# Altium schematic sheet passive_balancing.SchDoc: foxBMS BMS-Slave 12-Cell
size A3; DocumentNumber: 7; SheetNumber: 7; SheetTotal: 19; AUTHOR: Fraunhofer IISB foxBMS Team; SheetDescription: Passive Cell Balancing
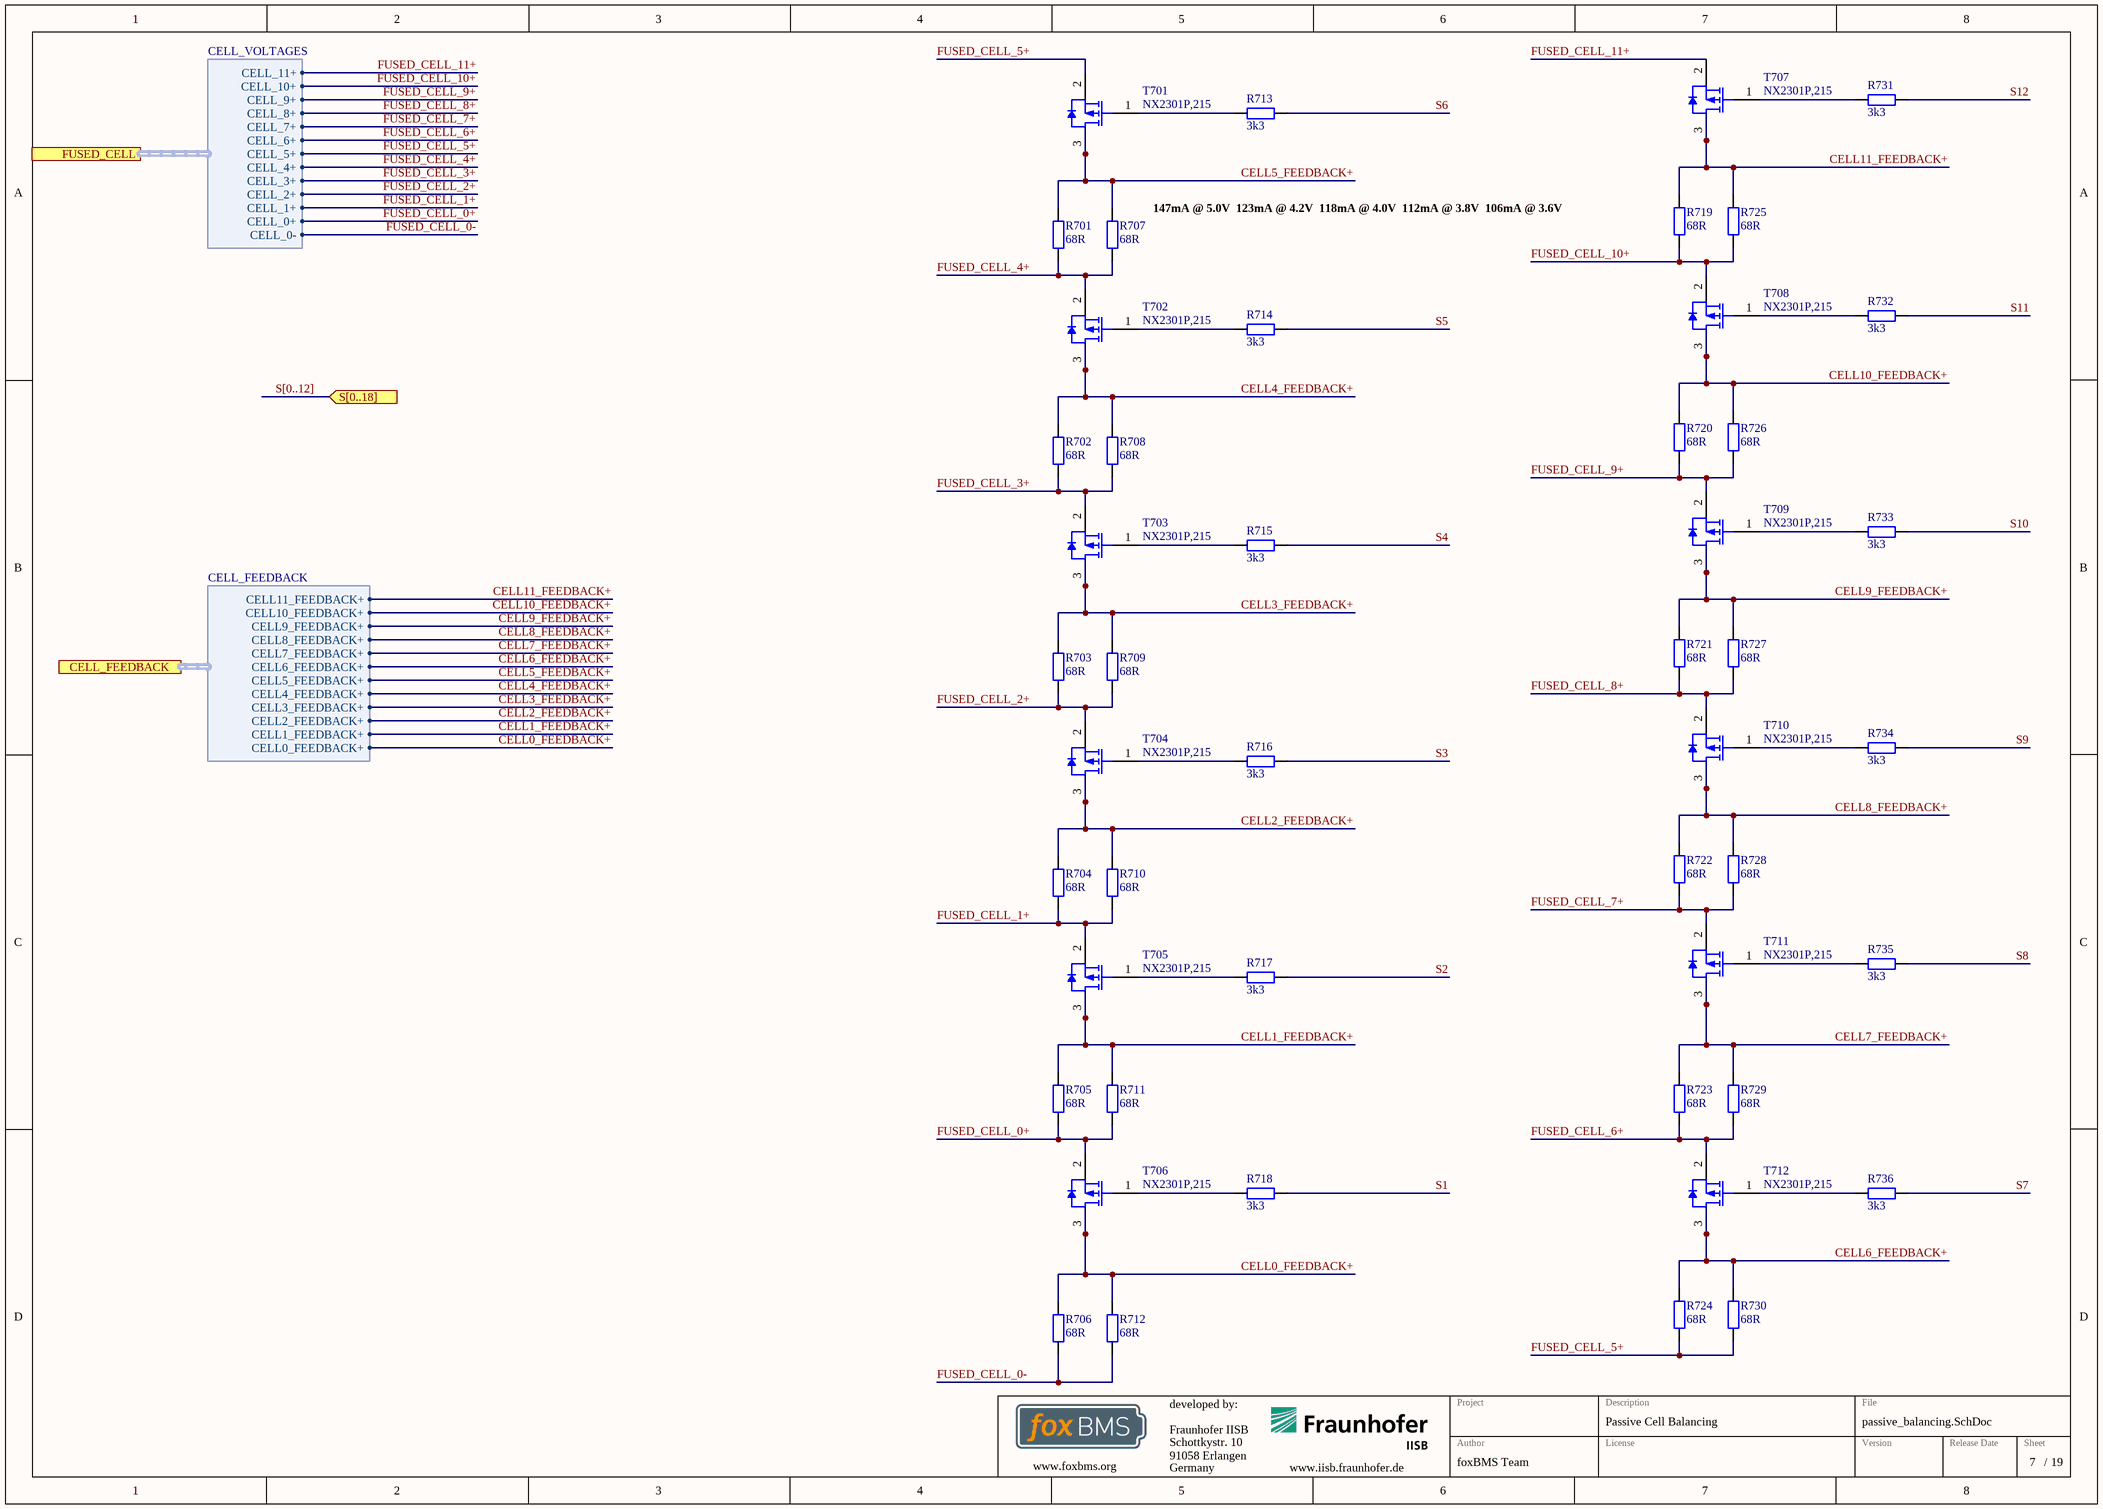
[diagram p0: passive_balancing.SchDoc]

## Parts
R701  68R  [RESC5025X07N]
R702  68R  [RESC5025X07N]
R703  68R  [RESC5025X07N]
R704  68R  [RESC5025X07N]
R705  68R  [RESC5025X07N]
R706  68R  [RESC5025X07N]
R707  68R  [RESC5025X07N]
R708  68R  [RESC5025X07N]
R709  68R  [RESC5025X07N]
R710  68R  [RESC5025X07N]
R711  68R  [RESC5025X07N]
R712  68R  [RESC5025X07N]
R713  3k3  [RESC1608X05N]
R714  3k3  [RESC1608X05N]
R715  3k3  [RESC1608X05N]
R716  3k3  [RESC1608X05N]
R717  3k3  [RESC1608X05N]
R718  3k3  [RESC1608X05N]
R719  68R  [RESC5025X07N]
R720  68R  [RESC5025X07N]
R721  68R  [RESC5025X07N]
R722  68R  [RESC5025X07N]
R723  68R  [RESC5025X07N]
R724  68R  [RESC5025X07N]
R725  68R  [RESC5025X07N]
R726  68R  [RESC5025X07N]
R727  68R  [RESC5025X07N]
R728  68R  [RESC5025X07N]
R729  68R  [RESC5025X07N]
R730  68R  [RESC5025X07N]
R731  3k3  [RESC1608X05N]
R732  3k3  [RESC1608X05N]
R733  3k3  [RESC1608X05N]
R734  3k3  [RESC1608X05N]
R735  3k3  [RESC1608X05N]
R736  3k3  [RESC1608X05N]
T701  NX2301P,215  [NXP-SOT23_N]
T702  NX2301P,215  [NXP-SOT23_N]
T703  NX2301P,215  [NXP-SOT23_N]
T704  NX2301P,215  [NXP-SOT23_N]
T705  NX2301P,215  [NXP-SOT23_N]
T706  NX2301P,215  [NXP-SOT23_N]
T707  NX2301P,215  [NXP-SOT23_N]
T708  NX2301P,215  [NXP-SOT23_N]
T709  NX2301P,215  [NXP-SOT23_N]
T710  NX2301P,215  [NXP-SOT23_N]
T711  NX2301P,215  [NXP-SOT23_N]
T712  NX2301P,215  [NXP-SOT23_N]

## Ports
CELL_FEEDBACK (harness CELL_FEEDBACK), FUSED_CELL (harness CELL_VOLTAGES), S[0..18] (in)

## Harnesses
CELL_VOLTAGES: CELL_0-, CELL_0+, CELL_1+, CELL_10+, CELL_11+, CELL_2+, CELL_3+, CELL_4+, CELL_5+, CELL_6+, CELL_7+, CELL_8+, CELL_9+
CELL_FEEDBACK: CELL11_FEEDBACK+, CELL10_FEEDBACK+, CELL9_FEEDBACK+, CELL8_FEEDBACK+, CELL7_FEEDBACK+, CELL6_FEEDBACK+, CELL5_FEEDBACK+, CELL4_FEEDBACK+, CELL3_FEEDBACK+, CELL2_FEEDBACK+, CELL1_FEEDBACK+, CELL0_FEEDBACK+

## Nets
CELL0_FEEDBACK+: R706.2 R712.2 T706.3(D) ; port CELL_FEEDBACK.CELL0_FEEDBACK+
CELL1_FEEDBACK+: R705.2 R711.2 T705.3(D) ; port CELL_FEEDBACK.CELL1_FEEDBACK+
CELL2_FEEDBACK+: R704.2 R710.2 T704.3(D) ; port CELL_FEEDBACK.CELL2_FEEDBACK+
CELL3_FEEDBACK+: R703.2 R709.2 T703.3(D) ; port CELL_FEEDBACK.CELL3_FEEDBACK+
CELL4_FEEDBACK+: R702.2 R708.2 T702.3(D) ; port CELL_FEEDBACK.CELL4_FEEDBACK+
CELL5_FEEDBACK+: R701.2 R707.2 T701.3(D) ; port CELL_FEEDBACK.CELL5_FEEDBACK+
CELL6_FEEDBACK+: R724.2 R730.2 T712.3(D) ; port CELL_FEEDBACK.CELL6_FEEDBACK+
CELL7_FEEDBACK+: R723.2 R729.2 T711.3(D) ; port CELL_FEEDBACK.CELL7_FEEDBACK+
CELL8_FEEDBACK+: R722.2 R728.2 T710.3(D) ; port CELL_FEEDBACK.CELL8_FEEDBACK+
CELL9_FEEDBACK+: R721.2 R727.2 T709.3(D) ; port CELL_FEEDBACK.CELL9_FEEDBACK+
CELL10_FEEDBACK+: R720.2 R726.2 T708.3(D) ; port CELL_FEEDBACK.CELL10_FEEDBACK+
CELL11_FEEDBACK+: R719.2 R725.2 T707.3(D) ; port CELL_FEEDBACK.CELL11_FEEDBACK+
FUSED_CELL_0+: R705.1 R711.1 T706.2(S) ; port FUSED_CELL.CELL_0+
FUSED_CELL_0-: R706.1 R712.1 ; port FUSED_CELL.CELL_0-
FUSED_CELL_1+: R704.1 R710.1 T705.2(S) ; port FUSED_CELL.CELL_1+
FUSED_CELL_2+: R703.1 R709.1 T704.2(S) ; port FUSED_CELL.CELL_2+
FUSED_CELL_3+: R702.1 R708.1 T703.2(S) ; port FUSED_CELL.CELL_3+
FUSED_CELL_4+: R701.1 R707.1 T702.2(S) ; port FUSED_CELL.CELL_4+
FUSED_CELL_5+: R724.1 R730.1 T701.2(S) ; port FUSED_CELL.CELL_5+
FUSED_CELL_6+: R723.1 R729.1 T712.2(S) ; port FUSED_CELL.CELL_6+
FUSED_CELL_7+: R722.1 R728.1 T711.2(S) ; port FUSED_CELL.CELL_7+
FUSED_CELL_8+: R721.1 R727.1 T710.2(S) ; port FUSED_CELL.CELL_8+
FUSED_CELL_9+: R720.1 R726.1 T709.2(S) ; port FUSED_CELL.CELL_9+
FUSED_CELL_10+: R719.1 R725.1 T708.2(S) ; port FUSED_CELL.CELL_10+
FUSED_CELL_11+: T707.2(S) ; port FUSED_CELL.CELL_11+
S1: R718.2
S2: R717.2
S3: R716.2
S4: R715.2
S5: R714.2
S6: R713.2
S7: R736.2
S8: R735.2
S9: R734.2
S10: R733.2
S11: R732.2
S12: R731.2
NetR713_1: R713.1 T701.1(G)
NetR714_1: R714.1 T702.1(G)
NetR715_1: R715.1 T703.1(G)
NetR716_1: R716.1 T704.1(G)
NetR717_1: R717.1 T705.1(G)
NetR718_1: R718.1 T706.1(G)
NetR731_1: R731.1 T707.1(G)
NetR732_1: R732.1 T708.1(G)
NetR733_1: R733.1 T709.1(G)
NetR734_1: R734.1 T710.1(G)
NetR735_1: R735.1 T711.1(G)
NetR736_1: R736.1 T712.1(G)

## Buses and harness runs
bus S[0..12] = port S[0..18]

## Notes on the sheet
- (near R707) 147mA @ 5.0V
  123mA @ 4.2V
  118mA @ 4.0V
  112mA @ 3.8V
  106mA @ 3.6V
- Fraunhofer IISB
- Schottkystr. 10
- developed by:
- 91058 Erlangen
- Germany
- Author
- Project
- License
- Description
- File
- Version
- Release Date
- Sheet
- www.foxbms.org
- www.iisb.fraunhofer.de
- foxBMS Team
- /

## Library data of the parts
R701-R712 R719-R730 = gen_R_68R_2010: SMD Resistor 68R 2010; Tolerance: 1%; Power: 0.75W; Case EIA: 2010; Case Metric: 5025; Maximum Working Voltage: 200V; PnP Package: R_2010; Automotive Qualified: False; Part Number: gen_R_68R_2010; Operating Temperature: -55°C - +155°C; Resistance: 68R; Series: E24; PnP Value: 68R; Supplier 1: Farnell; Supplier Part Number 1: 2323988
R713-R718 R731-R736 = gen_R_3k3_0603: SMD Resistor 3k3 0603; Tolerance: 1%; Power: 0.1W; Case EIA: 0603; Case Metric: 1608; Maximum Working Voltage: 75V; PnP Package: R_0603; Automotive Qualified: False; Part Number: gen_R_3k3_0603; Operating Temperature: -55°C - +155°C; Resistance: 3k3; Series: E24; PnP Value: 3k3; Supplier 1: Farnell; Supplier Part Number 1: 1469793
T701-T712 = CMP-1259-00090-1: P-Channel Trench MOSFET, -20 V, -2 A, -55 to 150 degC, 3-Pin SOT23, Tape and Reel; Manufacturer: NXP Semiconductors; VGSth [typ] (V): -0.75; Channel Type: P; Packing: Tape & Reel; Automotive Qualified: Y; IDM [max] (A): -6; PackageReference: SOT23; PartNumber: NX2301P,215; PackageVersion: 06-03-16, 03/2006; ComponentLink1URL: http://www.nxp.com/; ID [max] (A): -2; Mounting Technology: Surface Mount; ComponentLink1Description: Manufacturer URL; VDS [max] (V): -20; Code_JEDEC: TO-236AB; DatasheetVersion: Rev. 1; ComponentLink3URL: http://www.nxp.com/documents/outline_drawing/sot023_po.pdf; ComponentLink2Description: Datasheet; PackageDescription: 3-Pin Small Outline Transistor Package, Body 2.9 x 1.3 mm, Pitch 0.95 mm; ComponentLink3Description: Package Specification; ComponentLink2URL: http://www.nxp.com/documents/data_sheet/NX2301P.pdf